# Altium project fpga_board.PrjPcb (part 2 of 2)

## Sheet FPGA2.SchDoc
size A4; SheetNumber: 8; SheetTotal: 9
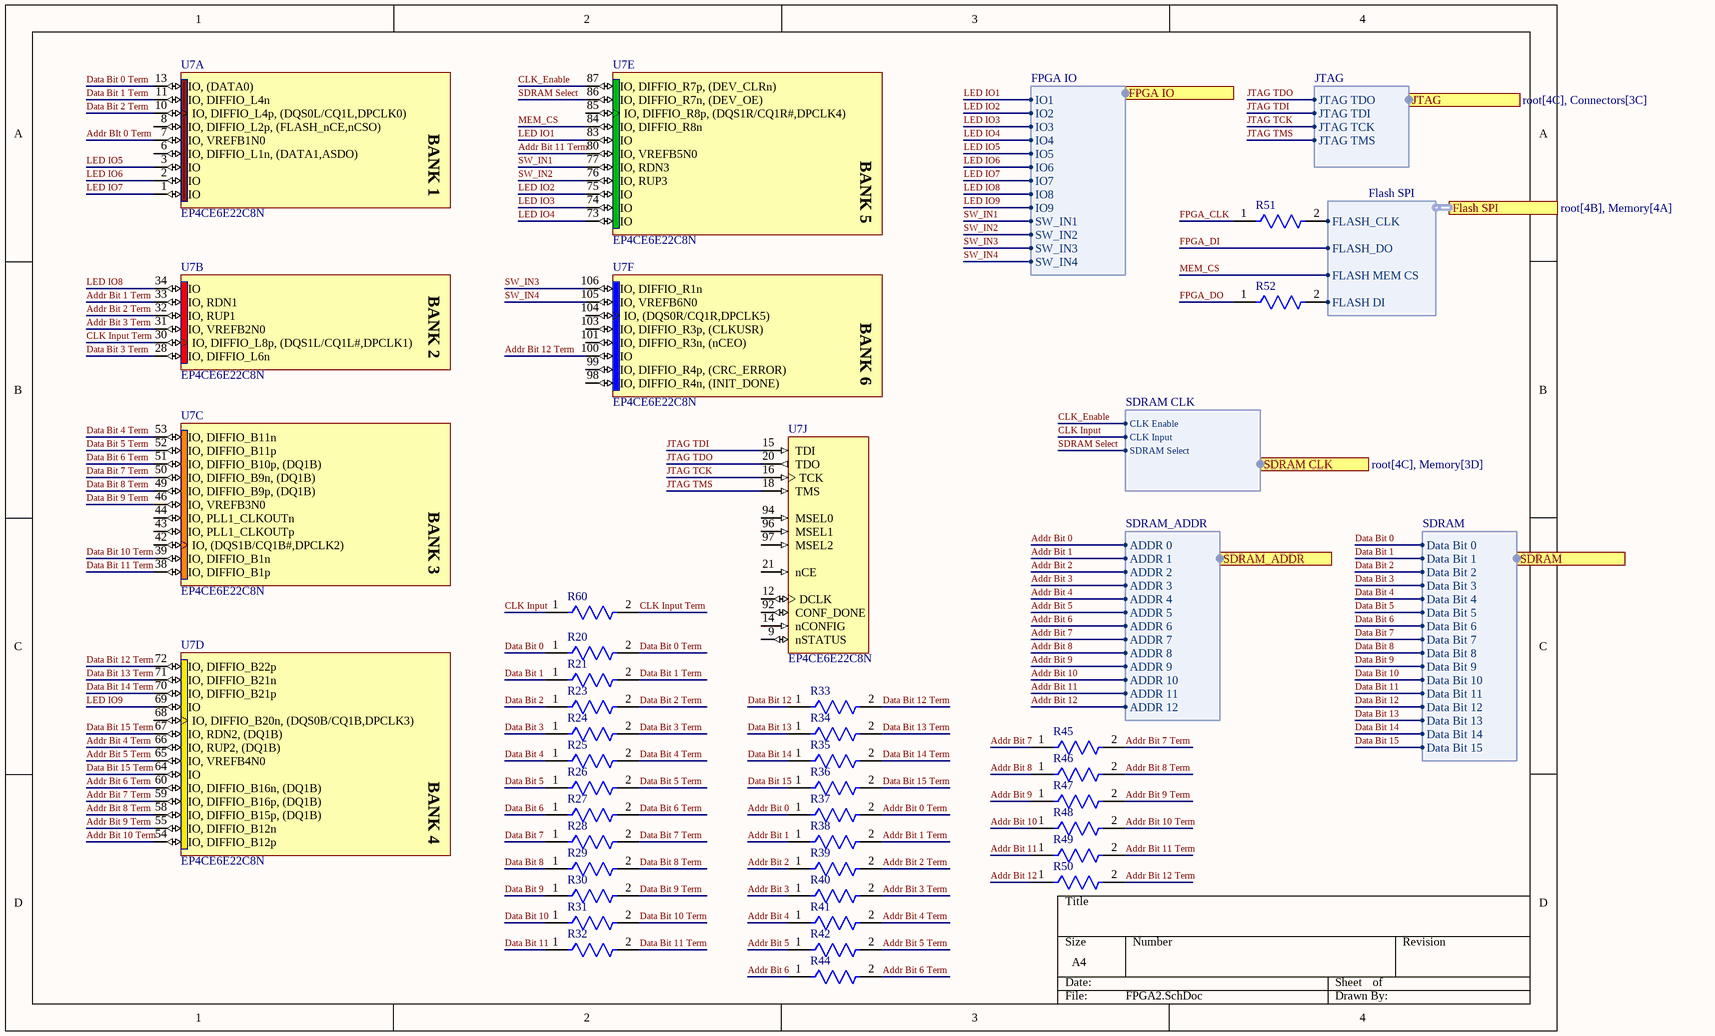
[diagram p7: FPGA2.SchDoc]

### Parts
R20  RT0402BRE0750RL  [FP-RT0402-0_35-MFG]  (value not drawn)
R21  RT0402BRE0750RL  [FP-RT0402-0_35-MFG]  (value not drawn)
R23  RT0402BRE0750RL  [FP-RT0402-0_35-MFG]  (value not drawn)
R24  RT0402BRE0750RL  [FP-RT0402-0_35-MFG]  (value not drawn)
R25  RT0402BRE0750RL  [FP-RT0402-0_35-MFG]  (value not drawn)
R26  RT0402BRE0750RL  [FP-RT0402-0_35-MFG]  (value not drawn)
R27  RT0402BRE0750RL  [FP-RT0402-0_35-MFG]  (value not drawn)
R28  RT0402BRE0750RL  [FP-RT0402-0_35-MFG]  (value not drawn)
R29  RT0402BRE0750RL  [FP-RT0402-0_35-MFG]  (value not drawn)
R30  RT0402BRE0750RL  [FP-RT0402-0_35-MFG]  (value not drawn)
R31  RT0402BRE0750RL  [FP-RT0402-0_35-MFG]  (value not drawn)
R32  RT0402BRE0750RL  [FP-RT0402-0_35-MFG]  (value not drawn)
R33  RT0402BRE0750RL  [FP-RT0402-0_35-MFG]  (value not drawn)
R34  RT0402BRE0750RL  [FP-RT0402-0_35-MFG]  (value not drawn)
R35  RT0402BRE0750RL  [FP-RT0402-0_35-MFG]  (value not drawn)
R36  RT0402BRE0750RL  [FP-RT0402-0_35-MFG]  (value not drawn)
R37  RT0402BRE0750RL  [FP-RT0402-0_35-MFG]  (value not drawn)
R38  RT0402BRE0750RL  [FP-RT0402-0_35-MFG]  (value not drawn)
R39  RT0402BRE0750RL  [FP-RT0402-0_35-MFG]  (value not drawn)
R40  RT0402BRE0750RL  [FP-RT0402-0_35-MFG]  (value not drawn)
R41  RT0402BRE0750RL  [FP-RT0402-0_35-MFG]  (value not drawn)
R42  RT0402BRE0750RL  [FP-RT0402-0_35-MFG]  (value not drawn)
R44  RT0402BRE0750RL  [FP-RT0402-0_35-MFG]  (value not drawn)
R45  RT0402BRE0750RL  [FP-RT0402-0_35-MFG]  (value not drawn)
R46  RT0402BRE0750RL  [FP-RT0402-0_35-MFG]  (value not drawn)
R47  RT0402BRE0750RL  [FP-RT0402-0_35-MFG]  (value not drawn)
R48  RT0402BRE0750RL  [FP-RT0402-0_35-MFG]  (value not drawn)
R49  RT0402BRE0750RL  [FP-RT0402-0_35-MFG]  (value not drawn)
R50  RT0402BRE0750RL  [FP-RT0402-0_35-MFG]  (value not drawn)
R51  RT0402BRE0750RL  [FP-RT0402-0_35-MFG]  (value not drawn)
R52  RT0402BRE0750RL  [FP-RT0402-0_35-MFG]  (value not drawn)
R60  RT0402BRE0750RL  [FP-RT0402-0_35-MFG]  (value not drawn)
U7  EP4CE6E22C8N  [EQFP144_A-165_D2-54_M]  (parts A,B,C,D,E,F,J of 13)

### Ports
Flash SPI (harness Flash SPI, see root[4B], Memory[4A]), FPGA IO (harness FPGA IO, see root[4B], IOs[1A]), JTAG (harness JTAG, see root[4C], Connectors[3C]), SDRAM (harness SDRAM, see root[4B], Memory[3B]), SDRAM CLK (harness SDRAM CLK, see root[4C], Memory[3D]), SDRAM_ADDR (harness SDRAM_ADDR, see root[4B], Memory[3C])

### Harnesses
JTAG: JTAG TDO, JTAG TDI, JTAG TCK, JTAG TMS
FPGA IO: IO1, IO2, IO3, IO4, IO5, IO6, IO7, IO8, IO9, SW_IN1, SW_IN2, SW_IN3, SW_IN4
Flash SPI: FLASH_CLK, FLASH_DO, FLASH MEM CS, FLASH DI
SDRAM: Data Bit 0, Data Bit 1, Data Bit 2, Data Bit 3, Data Bit 4, Data Bit 5, Data Bit 6, Data Bit 7, Data Bit 8, Data Bit 9, Data Bit 10, Data Bit 11, Data Bit 12, Data Bit 13, Data Bit 14, Data Bit 15
SDRAM_ADDR: ADDR 0, ADDR 1, ADDR 2, ADDR 3, ADDR 4, ADDR 5, ADDR 6, ADDR 7, ADDR 8, ADDR 9, ADDR 10, ADDR 11, ADDR 12
SDRAM CLK: CLK Enable, CLK Input, SDRAM Select

### Nets
Addr Bit 0: R37.1 ; port SDRAM_ADDR.ADDR 0
Addr BIt 0 Term: R37.2 U7.7(IO,_VREFB1N0)
Addr Bit 1: R38.1 ; port SDRAM_ADDR.ADDR 1
Addr Bit 1 Term: R38.2 U7.33(IO,_RDN1)
Addr Bit 2: R39.1 ; port SDRAM_ADDR.ADDR 2
Addr Bit 2 Term: R39.2 U7.32(IO,_RUP1)
Addr Bit 3: R40.1 ; port SDRAM_ADDR.ADDR 3
Addr Bit 3 Term: R40.2 U7.31(IO,_VREFB2N0)
Addr Bit 4: R41.1 ; port SDRAM_ADDR.ADDR 4
Addr Bit 4 Term: R41.2 U7.66(IO,_RUP2,_(DQ1B))
Addr Bit 5: R42.1 ; port SDRAM_ADDR.ADDR 5
Addr Bit 5 Term: R42.2 U7.65(IO,_VREFB4N0)
Addr Bit 6: R44.1 ; port SDRAM_ADDR.ADDR 6
Addr Bit 6 Term: R44.2 U7.60(IO,_DIFFIO_B16n,_(DQ1B))
Addr Bit 7: R45.1 ; port SDRAM_ADDR.ADDR 7
Addr Bit 7 Term: R45.2 U7.59(IO,_DIFFIO_B16p,_(DQ1B))
Addr Bit 8: R46.1 ; port SDRAM_ADDR.ADDR 8
Addr Bit 8 Term: R46.2 U7.58(IO,_DIFFIO_B15p,_(DQ1B))
Addr Bit 9: R47.1 ; port SDRAM_ADDR.ADDR 9
Addr Bit 9 Term: R47.2 U7.55(IO,_DIFFIO_B12n)
Addr Bit 10: R48.1 ; port SDRAM_ADDR.ADDR 10
Addr Bit 10 Term: R48.2 U7.54(IO,_DIFFIO_B12p)
Addr Bit 11: R49.1 ; port SDRAM_ADDR.ADDR 11
Addr Bit 11 Term: R49.2 U7.80(IO,_VREFB5N0)
Addr Bit 12: R50.1 ; port SDRAM_ADDR.ADDR 12
Addr Bit 12 Term: R50.2 U7.100(IO)
CLK Input: R60.1 ; port SDRAM CLK.CLK Input
CLK Input Term: R60.2 U7.30(IO,_DIFFIO_L8p,_(DQS1L/CQ1L#,DPCLK1))
CLK_Enable: U7.87(IO,_DIFFIO_R7p,_(DEV_CLRn)) ; port SDRAM CLK.CLK Enable
Data Bit 0: R20.1 ; port SDRAM.Data Bit 0
Data Bit 0 Term: R20.2 U7.13(IO,_(DATA0))
Data Bit 1: R21.1 ; port SDRAM.Data Bit 1
Data Bit 1 Term: R21.2 U7.11(IO,_DIFFIO_L4n)
Data Bit 2: R23.1 ; port SDRAM.Data Bit 2
Data Bit 2 Term: R23.2 U7.10(IO,_DIFFIO_L4p,_(DQS0L/CQ1L,DPCLK0))
Data Bit 3: R24.1 ; port SDRAM.Data Bit 3
Data Bit 3 Term: R24.2 U7.28(IO,_DIFFIO_L6n)
Data Bit 4: R25.1 ; port SDRAM.Data Bit 4
Data Bit 4 Term: R25.2 U7.53(IO,_DIFFIO_B11n)
Data Bit 5: R26.1 ; port SDRAM.Data Bit 5
Data Bit 5 Term: R26.2 U7.52(IO,_DIFFIO_B11p)
Data Bit 6: R27.1 ; port SDRAM.Data Bit 6
Data Bit 6 Term: R27.2 U7.51(IO,_DIFFIO_B10p,_(DQ1B))
Data Bit 7: R28.1 ; port SDRAM.Data Bit 7
Data Bit 7 Term: R28.2 U7.50(IO,_DIFFIO_B9n,_(DQ1B))
Data Bit 8: R29.1 ; port SDRAM.Data Bit 8
Data Bit 8 Term: R29.2 U7.49(IO,_DIFFIO_B9p,_(DQ1B))
Data Bit 9: R30.1 ; port SDRAM.Data Bit 9
Data Bit 9 Term: R30.2 U7.46(IO,_VREFB3N0)
Data Bit 10: R31.1 ; port SDRAM.Data Bit 10
Data Bit 10 Term: R31.2 U7.39(IO,_DIFFIO_B1n)
Data Bit 11: R32.1 ; port SDRAM.Data Bit 11
Data Bit 11 Term: R32.2 U7.38(IO,_DIFFIO_B1p)
Data Bit 12: R33.1 ; port SDRAM.Data Bit 12
Data Bit 12 Term: R33.2 U7.72(IO,_DIFFIO_B22p)
Data Bit 13: R34.1 ; port SDRAM.Data Bit 13
Data Bit 13 Term: R34.2 U7.71(IO,_DIFFIO_B21n)
Data Bit 14: R35.1 ; port SDRAM.Data Bit 14
Data Bit 14 Term: R35.2 U7.70(IO,_DIFFIO_B21p)
Data Bit 15: R36.1 ; port SDRAM.Data Bit 15
Data Bit 15 Term: R36.2 U7.64(IO) U7.67(IO,_RDN2,_(DQ1B))
FPGA_CLK: R51.2 ; port Flash SPI.FLASH_CLK
FPGA_CLK: R51.1  [a separate net that carries the same name]
FPGA_DO: R52.2 ; port Flash SPI.FLASH DI
FPGA_DO: R52.1  [a separate net that carries the same name]
JTAG TCK: U7.16(TCK) ; port JTAG.JTAG TCK
JTAG TDI: U7.15(TDI) ; port JTAG.JTAG TDI
JTAG TDO: U7.20(TDO) ; port JTAG.JTAG TDO
JTAG TMS: U7.18(TMS) ; port JTAG.JTAG TMS
LED IO1: U7.83(IO) ; port FPGA IO.IO1  [project net IO1]
LED IO2: U7.75(IO) ; port FPGA IO.IO2  [project net IO2]
LED IO3: U7.74(IO) ; port FPGA IO.IO3  [project net IO3]
LED IO4: U7.73(IO) ; port FPGA IO.IO4  [project net IO4]
LED IO5: U7.3(IO) ; port FPGA IO.IO5  [project net IO5]
LED IO6: U7.2(IO) ; port FPGA IO.IO6  [project net IO6]
LED IO7: U7.1(IO) ; port FPGA IO.IO7  [project net IO7]
LED IO8: U7.34(IO) ; port FPGA IO.IO8  [project net IO8]
LED IO9: U7.69(IO) ; port FPGA IO.IO9  [project net IO9]
MEM_CS: U7.84(IO,_DIFFIO_R8n) ; port Flash SPI.FLASH MEM CS
SDRAM Select: U7.86(IO,_DIFFIO_R7n,_(DEV_OE)) ; port SDRAM CLK.SDRAM Select
SW_IN1: U7.77(IO,_RDN3) ; port FPGA IO.SW_IN1
SW_IN2: U7.76(IO,_RUP3) ; port FPGA IO.SW_IN2
SW_IN3: U7.106(IO,_DIFFIO_R1n) ; port FPGA IO.SW_IN3
SW_IN4: U7.105(IO,_VREFB6N0) ; port FPGA IO.SW_IN4

Not connected (* = marked no-connect by the designer): U7 6(IO,_DIFFIO_L1n,_(DATA1,ASDO)) 8(IO,_DIFFIO_L2p,_(FLASH_nCE,nCSO)) 9(nSTATUS) 12(DCLK) 14(nCONFIG) 21(nCE) 42(IO,_(DQS1B/CQ1B#,DPCLK2)) 43(IO,_PLL1_CLKOUTp) 44(IO,_PLL1_CLKOUTn) 68(IO,_DIFFIO_B20n,_(DQS0B/CQ1B,DPCLK3)) 85(IO,_DIFFIO_R8p,_(DQS1R/CQ1R#,DPCLK4)) 92(CONF_DONE) 94(MSEL0) 96(MSEL1) 97(MSEL2) 98(IO,_DIFFIO_R4n,_(INIT_DONE)) 99(IO,_DIFFIO_R4p,_(CRC_ERROR)) 101(IO,_DIFFIO_R3n,_(nCEO)) 103(IO,_DIFFIO_R3p,_(CLKUSR)) 104(IO,_(DQS0R/CQ1R,DPCLK5))

### Notes on the sheet
- (in symbol CMP-0038-00212-1, part A) BANK 1
- (in symbol CMP-0038-00212-1, part B) BANK 2
- (in symbol CMP-0038-00212-1, part C) BANK 3
- (in symbol CMP-0038-00212-1, part D) BANK 4
- (in symbol CMP-0038-00212-1, part E) BANK 5
- (in symbol CMP-0038-00212-1, part F) BANK 6

### Library data of the parts
R20 R21 R23-R42 R44-R52 R60 = CMP-00621-71392720-1: RT0402BRE0750RL Fixed Resistor, Thin Film, 0.0625W, 50ohm, 50V, 0.1% +/-Tol, 50ppm/Cel, Surface Mount, 0402; Max Power Dissipation: 63mW; Temperature Coefficient: 50ppm/°C; Resistance: 50Ω; Features: Moisture Resistant; Max Operating Temperature: 155°C; Tolerance: 0.1%; Min Operating Temperature: -55°C; Case/Package: 0402; Packaging: Tape & Reel; RoHS: Compliant; Width: 508µm; Height: 355.6µm; NexarPartId: 71392720; Composition: Thin Film; Length: 990.6µm; Number of Terminations: 2
U7 = CMP-0038-00212-1: Cyclone IV Family FPGA, 1.2V Core, 91 I/O Pins, 2 PLLs, 144-Pin QFP, Speed Grade 8, Commercial Grade, Pb-Free; Manufacturer: Altera; ComponentLink3Description: Pinout; ComponentLink4Description: Package Specification; DatasheetVersion: ver1.6, Nov-2011; ComponentLink1URL: http://www.altera.com/; ComponentLink2URL: http://www.altera.com/literature/hb/cyclone-iv/cyclone4-handbook.pdf; ComponentLink2Description: Handbook; PackageReference: EQFP144_A-165_D2-54; ComponentLink3URL: http://www.altera.com/literature/lit-dp.jsp?category=cyc%204&showspreadsheet=y; PackageVersion: ver1.0, Jan-2011; ComponentLink1Description: Manufacturer URL; ComponentLink4URL: http://www.altera.com/devicepackaging/04R00402-00.pdf; PackageDescription: 144-Pin Plastic Enhanced Quad Flat Pack (EQFP) - Wire Bond - A:1.65 - D2:5.4; Code_JEDEC: MS-026-BFB-HD

## Sheet FPGA3.SchDoc
size A4; SheetNumber: 9; SheetTotal: 9
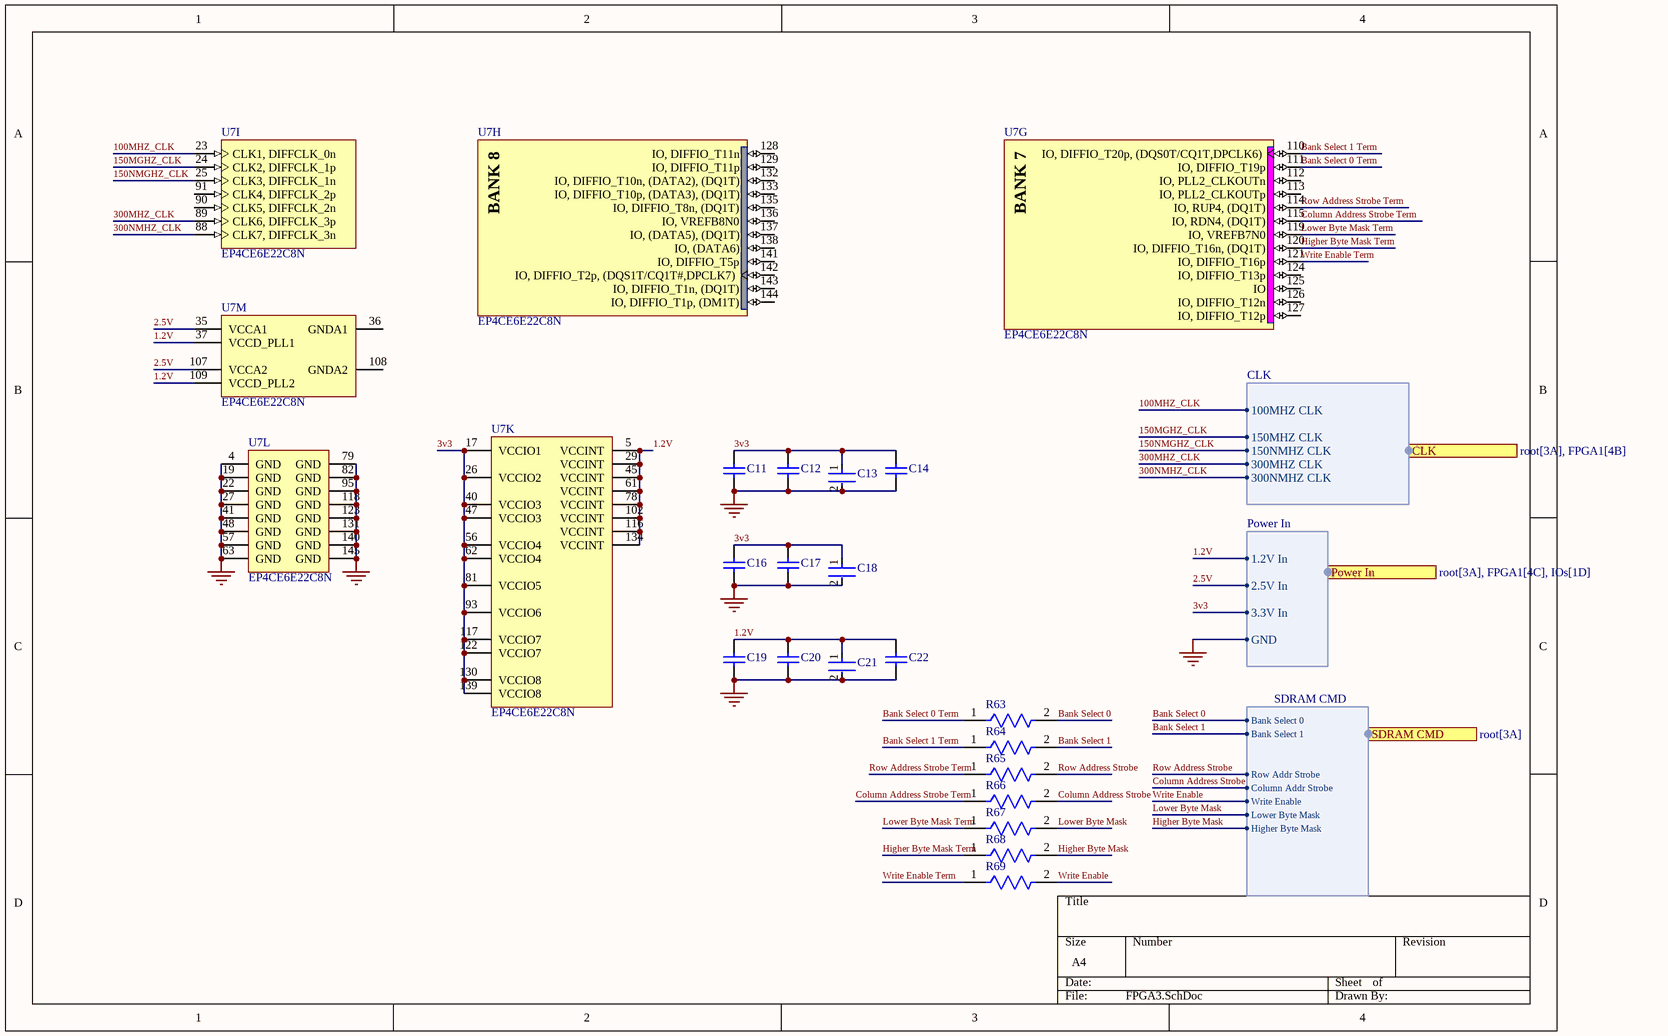
[diagram p8: FPGA3.SchDoc]

### Parts
C11  C0603C105K9PACTU  [CAPC1608X90X35LL15T15]  (value not drawn)
C12  C0603C105K9PACTU  [CAPC1608X90X35LL15T15]  (value not drawn)
C13  GCG188R91H104MA01D  [FP-GCG188-0_2-IPC_B]  (value not drawn)
C14  C0805S472K5RACTU  [CAPC2013X145X50ML20T25]  (value not drawn)
C16  C0603S102K4RACTU  [CAPC1608X87X35ML15T15]  (value not drawn)
C17  C0805S472K5RACTU  [CAPC2013X145X50ML20T25]  (value not drawn)
C18  GCG188R91H104MA01D  [FP-GCG188-0_2-IPC_B]  (value not drawn)
C19  C0603C105K9PACTU  [CAPC1608X90X35LL15T15]  (value not drawn)
C20  C0603C105K9PACTU  [CAPC1608X90X35LL15T15]  (value not drawn)
C21  GCG188R91H104MA01D  [FP-GCG188-0_2-IPC_B]  (value not drawn)
C22  C0805S472K5RACTU  [CAPC2013X145X50ML20T25]  (value not drawn)
R63  RT0402BRE0750RL  [FP-RT0402-0_35-MFG]  (value not drawn)
R64  RT0402BRE0750RL  [FP-RT0402-0_35-MFG]  (value not drawn)
R65  RT0402BRE0750RL  [FP-RT0402-0_35-MFG]  (value not drawn)
R66  RT0402BRE0750RL  [FP-RT0402-0_35-MFG]  (value not drawn)
R67  RT0402BRE0750RL  [FP-RT0402-0_35-MFG]  (value not drawn)
R68  RT0402BRE0750RL  [FP-RT0402-0_35-MFG]  (value not drawn)
R69  RT0402BRE0750RL  [FP-RT0402-0_35-MFG]  (value not drawn)
U7  EP4CE6E22C8N  [EQFP144_A-165_D2-54_M]  (parts G,H,I,K,L,M of 13)

### Ports
CLK (harness CLK, see root[3A], FPGA1[4B]), Power In (harness Power In, see root[3A], FPGA1[4C], IOs[1D]), SDRAM CMD (harness SDRAM CMD, see root[3A])

### Harnesses
Power In: 1.2V In, 2.5V In, 3.3V In, GND
CLK: 100MHZ CLK, 150MHZ CLK, 150NMHZ CLK, 300MHZ CLK, 300NMHZ CLK
SDRAM CMD: Bank Select 0, Bank Select 1, Row Addr Strobe, Column Addr Strobe, Write Enable, Lower Byte Mask, Higher Byte Mask

### Nets
3v3: C11.2 C12.2 C13.1 C14.2 C16.2 C17.2 C18.1 U7.17(VCCIO1) U7.26(VCCIO2) U7.40(VCCIO3) U7.47(VCCIO3) U7.56(VCCIO4) U7.62(VCCIO4) U7.81(VCCIO5) U7.93(VCCIO6) U7.117(VCCIO7) U7.122(VCCIO7) U7.130(VCCIO8) U7.139(VCCIO8) ; port Power In.3.3V In
GND: C11.1 C12.1 C13.2 C14.1 C16.1 C17.1 C18.2 C19.1 C20.1 C21.2 C22.1 U7.4(GND) U7.19(GND) U7.22(GND) U7.27(GND) U7.41(GND) U7.48(GND) U7.57(GND) U7.63(GND) U7.79(GND) U7.82(GND) U7.95(GND) U7.118(GND) U7.123(GND) U7.131(GND) U7.140(GND) U7.145(GND) ; port Power In.GND
1.2V: C19.2 C20.2 C21.1 C22.2 U7.5(VCCINT) U7.29(VCCINT) U7.37(VCCD_PLL1) U7.45(VCCINT) U7.61(VCCINT) U7.78(VCCINT) U7.102(VCCINT) U7.109(VCCD_PLL2) U7.116(VCCINT) U7.134(VCCINT) ; port Power In.1.2V In
2.5V: U7.35(VCCA1) U7.107(VCCA2) ; port Power In.2.5V In
100MHZ_CLK: U7.23(CLK1,_DIFFCLK_0n) ; port CLK.100MHZ CLK
150MGHZ_CLK: U7.24(CLK2,_DIFFCLK_1p) ; port CLK.150MHZ CLK
150NMGHZ_CLK: U7.25(CLK3,_DIFFCLK_1n) ; port CLK.150NMHZ CLK
300MHZ_CLK: U7.89(CLK6,_DIFFCLK_3p) ; port CLK.300MHZ CLK
300NMHZ_CLK: U7.88(CLK7,_DIFFCLK_3n) ; port CLK.300NMHZ CLK
Bank Select 0: R63.2 ; port SDRAM CMD.Bank Select 0
Bank Select 0 Term: R63.1 U7.111(IO,_DIFFIO_T19p)
Bank Select 1: R64.2 ; port SDRAM CMD.Bank Select 1
Bank Select 1 Term: R64.1 U7.110(IO,_DIFFIO_T20p,_(DQS0T/CQ1T,DPCLK6))
Column Address Strobe: R66.2 ; port SDRAM CMD.Column Addr Strobe
Column Address Strobe Term: R66.1 U7.115(IO,_RDN4,_(DQ1T))
Higher Byte Mask: R68.2 ; port SDRAM CMD.Higher Byte Mask
Higher Byte Mask Term: R68.1 U7.120(IO,_DIFFIO_T16n,_(DQ1T))
Lower Byte Mask: R67.2 ; port SDRAM CMD.Lower Byte Mask
Lower Byte Mask Term: R67.1 U7.119(IO,_VREFB7N0)
Row Address Strobe: R65.2 ; port SDRAM CMD.Row Addr Strobe
Row Address Strobe Term: R65.1 U7.114(IO,_RUP4,_(DQ1T))
Write Enable: R69.2 ; port SDRAM CMD.Write Enable
Write Enable Term: R69.1 U7.121(IO,_DIFFIO_T16p)

Not connected (* = marked no-connect by the designer): U7 36(GNDA1) 90(CLK5,_DIFFCLK_2n) 91(CLK4,_DIFFCLK_2p) 108(GNDA2) 112(IO,_PLL2_CLKOUTn) 113(IO,_PLL2_CLKOUTp) 124(IO,_DIFFIO_T13p) 125(IO) 126(IO,_DIFFIO_T12n) 127(IO,_DIFFIO_T12p) 128(IO,_DIFFIO_T11n) 129(IO,_DIFFIO_T11p) 132(IO,_DIFFIO_T10n,_(DATA2),_(DQ1T)) 133(IO,_DIFFIO_T10p,_(DATA3),_(DQ1T)) 135(IO,_DIFFIO_T8n,_(DQ1T)) 136(IO,_VREFB8N0) 137(IO,_(DATA5),_(DQ1T)) 138(IO,_(DATA6)) 141(IO,_DIFFIO_T5p) 142(IO,_DIFFIO_T2p,_(DQS1T/CQ1T#,DPCLK7)) 143(IO,_DIFFIO_T1n,_(DQ1T)) 144(IO,_DIFFIO_T1p,_(DM1T))

### Notes on the sheet
- (in symbol CMP-0038-00212-1, part G) BANK 7
- (in symbol CMP-0038-00212-1, part H) BANK 8

### Library data of the parts
C11 C12 C19 C20 = CMP-2006-02241-1: Manufacturer: Kemet; Part Number: C0603C105K9PACTU
C13 C18 C21 = CMP-06035-011350-1: AgPd Termination Conductive Glue Mounting Chip Multilayer Ceramic Capacitors for Automotive 0.1uF with 20% as tolerance, 50V X8R 15%, 0603 Package
C14 C17 C22 = CMP-2007-01090-1: Manufacturer: Kemet; Part Number: C0805S472K5RACTU
C16 = CMP-2006-03288-1: Manufacturer: Kemet; Part Number: C0603S102K4RACTU
R63-R69 = CMP-00621-71392720-1: as R20 on sheet FPGA2; Features: Moisture Resistant; Max Operating Temperature: 155°C; Tolerance: 0.1%; Min Operating Temperature: -55°C; Case/Package: 0402; Packaging: Tape & Reel; RoHS: Compliant; Width: 508µm; Height: 355.6µm; NexarPartId: 71392720; Composition: Thin Film; Length: 990.6µm; Number of Terminations: 2
U7 = CMP-0038-00212-1: as U7 on sheet FPGA2; ComponentLink3Description: Pinout; ComponentLink4Description: Package Specification; DatasheetVersion: ver1.6, Nov-2011; ComponentLink1URL: http://www.altera.com/; ComponentLink2URL: http://www.altera.com/literature/hb/cyclone-iv/cyclone4-handbook.pdf; ComponentLink2Description: Handbook; PackageReference: EQFP144_A-165_D2-54; ComponentLink3URL: http://www.altera.com/literature/lit-dp.jsp?category=cyc%204&showspreadsheet=y; PackageVersion: ver1.0, Jan-2011; ComponentLink1Description: Manufacturer URL; ComponentLink4URL: http://www.altera.com/devicepackaging/04R00402-00.pdf; PackageDescription: 144-Pin Plastic Enhanced Quad Flat Pack (EQFP) - Wire Bond - A:1.65 - D2:5.4; Code_JEDEC: MS-026-BFB-HD

## Nets that join several sheets
3v3: FPGA1 (13 pins), IOs (11 pins), FPGA3 (19 pins)
\: Memory (10 pins), Connectors (J2.A30 J2.A32 J2.B30 J2.B32), MCU (5 pins)
GND: FPGA1 (12 pins), IOs (26 pins), Power (14 pins), Memory (7 pins), MCU (23 pins), FPGA3 (27 pins)
100MHZ_CLK: FPGA1 (R_CLK1.1), FPGA3 (U7.23)
150MGHZ_CLK: FPGA1 (R_CLK2.1), FPGA3 (U7.24)
150NMGHZ_CLK: FPGA1 (R_CLK3.1), FPGA3 (U7.25)
300MHZ_CLK: FPGA1 (R_CLK_5.2), FPGA3 (U7.89)
300NMHZ_CLK: FPGA1 (R_CLK_4.2), FPGA3 (U7.88)
Addr Bit 0: Memory (B1.23), FPGA2 (R37.1)
Addr Bit 1: Memory (B1.24), FPGA2 (R38.1)
Addr Bit 2: Memory (B1.25), FPGA2 (R39.1)
Addr Bit 3: Memory (B1.26), FPGA2 (R40.1)
Addr Bit 4: Memory (B1.29), FPGA2 (R41.1)
Addr Bit 5: Memory (B1.30), FPGA2 (R42.1)
Addr Bit 6: Memory (B1.31), FPGA2 (R44.1)
Addr Bit 7: Memory (B1.32), FPGA2 (R45.1)
Addr Bit 8: Memory (B1.33), FPGA2 (R46.1)
Addr Bit 9: Memory (B1.34), FPGA2 (R47.1)
Addr Bit 10: Memory (B1.22), FPGA2 (R48.1)
Addr Bit 11: Memory (B1.35), FPGA2 (R49.1)
Addr Bit 12: Memory (B1.36), FPGA2 (R50.1)
Bank Select 0: Memory (B1.20), FPGA3 (R63.2)
Bank Select 1: Memory (B1.21), FPGA3 (R64.2)
CLK Input: Memory (B1.38), FPGA2 (R60.1)
CLK_Enable: Memory (B1.37), FPGA2 (U7.87)
Column Address Strobe: Memory (B1.17), FPGA3 (R66.2)
Data Bit 0: Memory (B1.2), FPGA2 (R20.1)
Data Bit 1: Memory (B1.4), FPGA2 (R21.1)
Data Bit 2: Memory (B1.5), FPGA2 (R23.1)
Data Bit 3: Memory (B1.7), FPGA2 (R24.1)
Data Bit 4: Memory (B1.8), FPGA2 (R25.1)
Data Bit 5: Memory (B1.10), FPGA2 (R26.1)
Data Bit 6: Memory (B1.11), FPGA2 (R27.1)
Data Bit 7: Memory (B1.13), FPGA2 (R28.1)
Data Bit 8: Memory (B1.42), FPGA2 (R29.1)
Data Bit 9: Memory (B1.44), FPGA2 (R30.1)
Data Bit 10: Memory (B1.45), FPGA2 (R31.1)
Data Bit 11: Memory (B1.47), FPGA2 (R32.1)
Data Bit 12: Memory (B1.48), FPGA2 (R33.1)
Data Bit 13: Memory (B1.50), FPGA2 (R34.1)
Data Bit 14: Memory (B1.51), FPGA2 (R35.1)
Data Bit 15: Memory (B1.53), FPGA2 (R36.1)
FPGA_CLK: Memory (FLASH_MEM_1.6), FPGA2 (R51.2)
FPGA_DO: Memory (FLASH_MEM_1.5), FPGA2 (R52.2)
Higher Byte Mask: Memory (B1.39), FPGA3 (R68.2)
IO1: IOs (M1_1.1 R1_2.2), FPGA2 (U7.83)
IO2: IOs (M2_1.1 R2_2.2), FPGA2 (U7.75)
IO3: IOs (M3_1.1 R3_2.2), FPGA2 (U7.74)
IO4: IOs (M4_1.1 R4_2.2), FPGA2 (U7.73)
IO5: IOs (M5_1.1 R5_2.2), FPGA2 (U7.3)
IO6: IOs (M6_1.1 R6_2.2), FPGA2 (U7.2)
IO7: IOs (M7_1.1 R7_2.2), FPGA2 (U7.1)
IO8: IOs (M8_1.1 R8_2.2), FPGA2 (U7.34)
IO9: IOs (M9_1.1 R9_2.2), FPGA2 (U7.69)
JTAG TCK: Connectors (P1.1), FPGA2 (U7.16)
JTAG TDI: Connectors (P1.9), FPGA2 (U7.15)
JTAG TDO: Connectors (P1.3), FPGA2 (U7.20)
JTAG TMS: Connectors (P1.5), FPGA2 (U7.18)
Lower Byte Mask: Memory (B1.15), FPGA3 (R67.2)
MEM_CS: Memory (FLASH_MEM_1.1 R_?#1.1), FPGA2 (U7.84)
Row Address Strobe: Memory (B1.18), FPGA3 (R65.2)
SDRAM Select: Memory (B1.19), FPGA2 (U7.86)
SW_IN1: IOs (R53.2 SW1.2), FPGA2 (U7.77)
SW_IN2: IOs (R54.2 SW2.2), FPGA2 (U7.76)
SW_IN3: IOs (R55.2 SW3.2), FPGA2 (U7.106)
SW_IN4: IOs (R56.2 SW4.2), FPGA2 (U7.105)
Write Enable: Memory (B1.16), FPGA3 (R69.2)